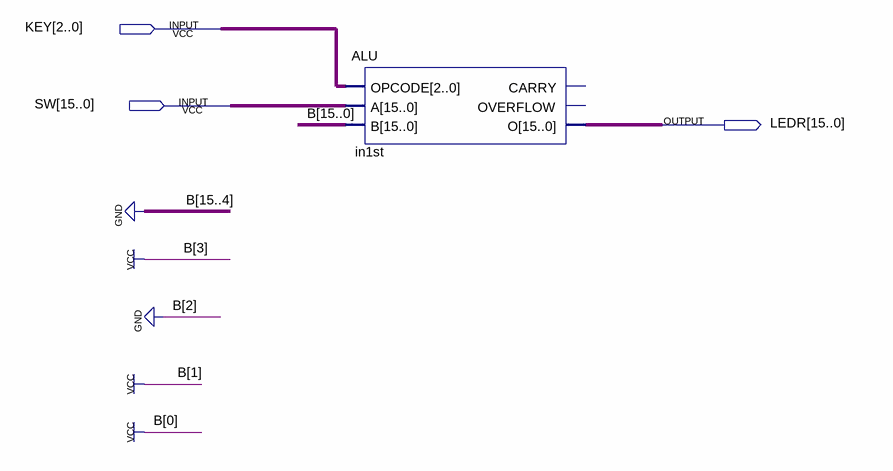
[diagram p0: schematic sheet]
// Quartus schematic KITDE2.bdf as structural Verilog: 1 symbols, 3 pins
module KITDE2 (
  input  [2:0] KEY,
  input  [15:0] SW,
  output [15:0] LEDR
);

  ALU in1st (.OPCODE(KEY), .A(SW), .B(16'b0000000000001011), .O(LEDR));  // open: CARRY, OVERFLOW
endmodule
